# Altium schematic sheet PV-Simulator.SCHDOC: PV Simulator
size A4; Author: Alex Murray; DrawnBy: Alex Murray; DocumentNumber: 1; SheetNumber: 1; SheetTotal: 6; CurrentTime: 14:14; CurrentDate: 15-10-29
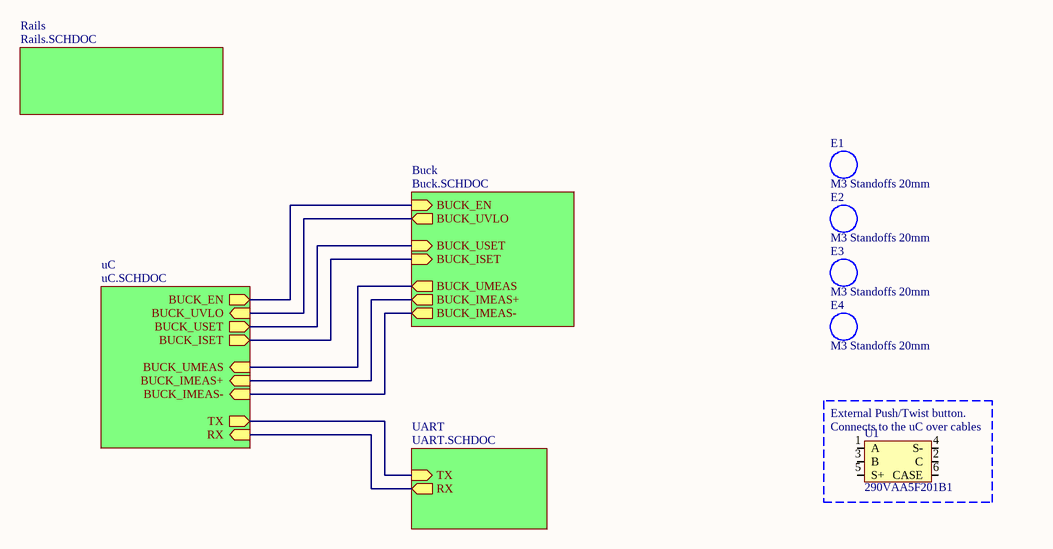
[diagram p0: PV-Simulator.SCHDOC]

## Parts
E1  Type: M3 Standoffs 20mm  [THT_STANDOFF_20MM_M3]  (hidden comment: E_STANDOFF_20MM_M3_PLASTIC)
E2  Type: M3 Standoffs 20mm  [THT_STANDOFF_20MM_M3]  (hidden comment: E_STANDOFF_20MM_M3_PLASTIC)
E3  Type: M3 Standoffs 20mm  [THT_STANDOFF_20MM_M3]  (hidden comment: E_STANDOFF_20MM_M3_PLASTIC)
E4  Type: M3 Standoffs 20mm  [THT_STANDOFF_20MM_M3]  (hidden comment: E_STANDOFF_20MM_M3_PLASTIC)
U1  Type: 290VAA5F201B1  [THT_ENCODER_290VAA5F201B1]  (hidden comment: U_ENCODER_2BIT_QUAD_SPST)

## Sub-sheets
Buck = Buck.SCHDOC: BUCK_ISET (in), BUCK_EN (in), BUCK_USET (in), BUCK_UMEAS (out), BUCK_IMEAS+ (out), BUCK_IMEAS- (out), BUCK_UVLO (out)
Rails = Rails.SCHDOC: no entries
UART = UART.SCHDOC: RX (out), TX (in)
uC = uC.SCHDOC: BUCK_USET (out), BUCK_ISET (out), BUCK_EN (out), BUCK_UMEAS (in), BUCK_IMEAS+ (in), BUCK_IMEAS- (in), RX (in), TX (out), BUCK_UVLO (in)

## Nets
(unnamed): sheet UART/RX, sheet uC/RX
(unnamed): sheet UART/TX, sheet uC/TX
(unnamed): sheet uC/BUCK_USET, sheet Buck/BUCK_USET
(unnamed): sheet uC/BUCK_ISET, sheet Buck/BUCK_ISET
(unnamed): sheet uC/BUCK_EN, sheet Buck/BUCK_EN
(unnamed): sheet uC/BUCK_UMEAS, sheet Buck/BUCK_UMEAS
(unnamed): sheet uC/BUCK_IMEAS+, sheet Buck/BUCK_IMEAS+
(unnamed): sheet uC/BUCK_IMEAS-, sheet Buck/BUCK_IMEAS-
(unnamed): sheet uC/BUCK_UVLO, sheet Buck/BUCK_UVLO

Not connected (* = marked no-connect by the designer): U1 1(A) 2(C) 3(B) 4(S-) 5(S+) 6(CASE)

## Notes on the sheet
- (near U1) External Push/Twist button.
- (near U1) Connects to the uC over cables

## Library data of the parts
E1-E4 = E_STANDOFF_20MM_M3_PLASTIC: HEX STANDOFF M3 NYLON 20MM; Supplier - Digikey: 36-25505-ND
U1 = U_ENCODER_2BIT_QUAD_SPST: 2 Bit Encoder with switch; Supplier - Digikey: CT3010-ND